# EAGLE schematic EEZ Arduino shield+BP r1B13a (EAGLE 6.1)
Assembly variants: Farnell, TME

## Sheet 1 of 5
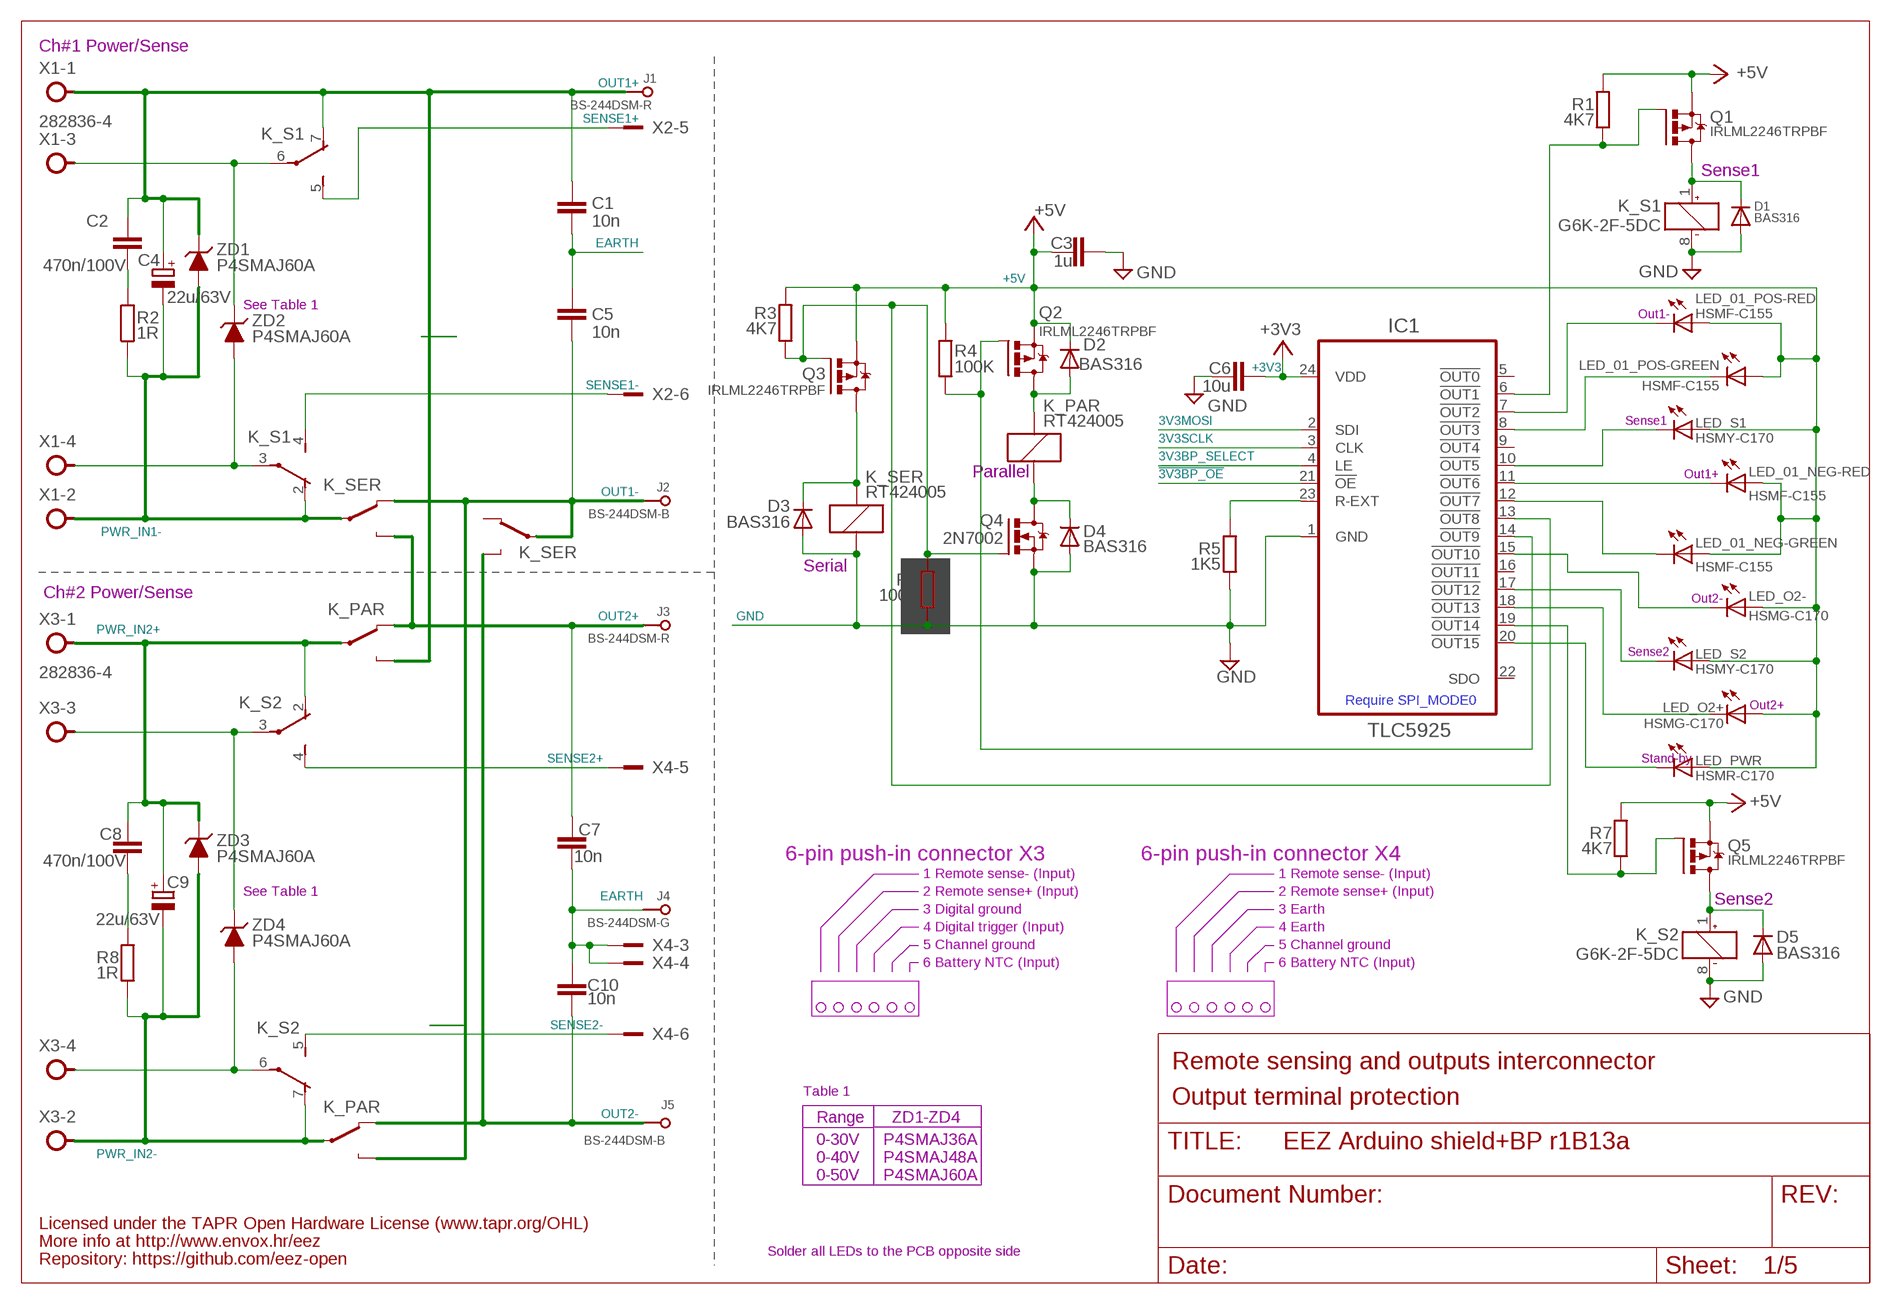
[diagram p0: schematic, sheet 1]

### Parts
C1  10n  C-EUC1206  [C1206]
C2  470n/100V  C-EUC1812  [C1812]
C3  1u  C-EUC0805  [C0805]
C4  22u/63V  ECAPEEEFK+2.5MM  [CAPAE660X610N_COMBO2]
C5  10n  C-EUC1206  [C1206]
C6  10u  C-EUC1206  [C1206]
C7  10n  C-EUC1206  [C1206]
C8  470n/100V  C-EUC1812  [C1812]
C9  22u/63V  ECAPEEEFK+2.5MM  [CAPAE660X610N_COMBO2]
C10  10n  C-EUC1206  [C1206]
D1  BAS316  DIODE-SOD323-W  [SOD323-W]
D2  BAS316  DIODE-SOD323-W  [SOD323-W]
D3  BAS316  DIODE-SOD323-W  [SOD323-W]
D4  BAS316  DIODE-SOD323-W  [SOD323-W]
D5  BAS316  DIODE-SOD323-W  [SOD323-W]
IC1  TLC5925  TLC5925IDBQR  [SOP63P600X175-24N]
J1  BS-244DSM-R  BINDING_POST-2  [BP_5_12]
J2  BS-244DSM-B  BINDING_POST-2  [BP_5_12]
J3  BS-244DSM-R  BINDING_POST-2  [BP_5_12]
J4  BS-244DSM-G  BINDING_POST-2  [BP_5_12]
J5  BS-244DSM-B  BINDING_POST-2  [BP_5_12]
K_PAR  RT424005  RELAY_RT314012-2  [RT-C/016A5_ROUND]
K_S1  G6K-2F-5DC  G6K-2F  [G6K-2F]
K_S2  G6K-2F-5DC  G6K-2F  [G6K-2F]
K_SER  RT424005  RELAY_RT314012-2  [RT-C/016A5_ROUND]
LED_01_NEG  HSMF-C155  LED_KPB-3025  [LED_KPB-3025]
LED_01_POS  HSMF-C155  LED_KPB-3025  [LED_KPB-3025]
LED_O2+  HSMG-C170  LEDCHIPLED_0805  [CHIPLED_0805]
LED_O2-  HSMG-C170  LEDCHIPLED_0805  [CHIPLED_0805]
LED_PWR  HSMR-C170  LEDCHIPLED_0805  [CHIPLED_0805]
LED_S1  HSMY-C170  LEDCHIPLED_0805  [CHIPLED_0805]
LED_S2  HSMY-C170  LEDCHIPLED_0805  [CHIPLED_0805]
Q1  IRLML2246TRPBF  [SOT95P237X112-3N]
Q2  IRLML2246TRPBF  [SOT95P237X112-3N]
Q3  IRLML2246TRPBF  [SOT95P237X112-3N]
Q4  2N7002  [SOT103P240X110-3N]
Q5  IRLML2246TRPBF  [SOT95P237X112-3N]
R1  4K7  R-EU_R0805  [R0805]
R2  1R  R-EU_R0805  [R0805]
R3  4K7  R-EU_R0805  [R0805]
R4  100K  R-EU_R0805  [R0805]
R5  1K5  R-EU_R0805  [R0805]
R6  100K  R-EU_R0805  [R0805]
R7  4K7  R-EU_R0805  [R0805]
R8  1R  R-EU_R0805  [R0805]
X1  282836-4  TBLOCK5.0_4A  [TBLOCK5.0_4]
X2  MC000005  MC000005MIRROR  [MC000005_MIRROR]
X3  282836-4  TBLOCK5.0_4A  [TBLOCK5.0_4]
X4  MC000005  MC000005MIRROR  [MC000005_MIRROR]
ZD1  P4SMAJ60A  PSMAXX  [DO214AC]
ZD2  P4SMAJ60A  PSMAXX  [DO214AC]
ZD3  P4SMAJ60A  PSMAXX  [DO214AC]
ZD4  P4SMAJ60A  PSMAXX  [DO214AC]

### Nets
3V3BP_SELECT: IC1.4(LE) ; also sheet 2
3V3MOSI: IC1.2(SDI) ; also sheet 2,3,4
3V3SCLK: IC1.3(CLK) ; also sheet 2,3,4
!3V3BP_OE: IC1.21(!OE) ; also sheet 2
!BP_OUT1: IC1.6(!OUT1) Q1.1(G) R1.1
!BP_OUT2: IC1.7(!OUT2) LED_01_POS.4(-RED:C)
!BP_OUT3: IC1.8(!OUT3) LED_01_POS.2(-GREEN:C)
!BP_OUT5: IC1.10(!OUT5) LED_S1.C
!BP_OUT6: IC1.11(!OUT6) LED_01_NEG.4(-RED:C)
!BP_OUT7: IC1.12(!OUT7) LED_01_NEG.2(-GREEN:C)
!BP_OUT8: IC1.13(!OUT8) Q3.1(G) Q4.1(G) R3.1 R6.2
!BP_OUT9: IC1.14(!OUT9) Q2.1(G) R4.1
!BP_OUT10: IC1.15(!OUT10) LED_O2-.C
!BP_OUT12: IC1.17(!OUT12) LED_S2.C
!BP_OUT13: IC1.18(!OUT13) LED_O2+.C
!BP_OUT14: IC1.19(!OUT14) Q5.1(G) R7.1
!BP_OUT15: IC1.20(!OUT15) LED_PWR.C
+3V3 [power]: C6.1 IC1.24(VDD) ; also sheet 2,3,4
+5V: C3.1 D2.C LED_01_NEG.1(-GREEN:A) LED_01_NEG.3(-RED:A) LED_01_POS.1(-GREEN:A) LED_01_POS.3(-RED:A) LED_O2+.A LED_O2-.A LED_PWR.A LED_S1.A LED_S2.A Q1.2(S) Q2.2(S) Q3.2(S) Q5.2(S) R1.2 R3.2 R4.2 R7.2 ; also sheet 2,4,5
EARTH: C1.2 C5.1 C7.2 C10.1 J4.P$1 X4.3 X4.3.1 X4.4 X4.4.1 ; also sheet 4
GND [gnd]: C3.2 C6.2 D1.A D3.A D4.A D5.A IC1.1(GND) K_S1.8(1:-) K_S2.8(1:-) K_SER.A1(C2) Q4.2(S) R5.1 R6.1 ; also sheet 2,3,4,5
N$5: K_S2.6(3:P) X3.P$4 ZD4.A
N$6: K_S1.6(3:P) X1.P$3 ZD2.C
N$7: K_S2.3(2:P) X3.P$3 ZD4.C
N$8: D1.C K_S1.1(1:+) Q1.3(D)
N$9: D5.C K_S2.1(1:+) Q5.3(D)
N$31: C2.2 R2.2
N$32: C8.2 R8.2
N$35: K_S1.3(2:P) X1.P$4 ZD2.A
N$155: D3.C K_SER.A2(C1) Q3.3(D)
N$156: D2.A K_PAR.A2(C1) Q2.3(D)
N$306: IC1.23(R-EXT) R5.2
OUT1+: C1.1 C2.1 C4.1(+) C4.1.1(+) J1.P$1 K_PAR.14A(O) K_S1.7(3:O) X1.P$1 ZD1.C
OUT1-: C5.2 J2.P$1 K_PAR.14B(O) K_SER.11B(P) K_SER.12A(S)
OUT2+: C7.1 J3.P$1 K_PAR.12A(S) K_SER.14A(O)
OUT2-: C10.2 J5.P$1 K_PAR.12B(S) K_SER.14B(O)
PWR_IN1-: C4.2(-) C4.2.1(-) K_S1.2(2:O) K_SER.11A(P) R2.1 X1.P$2 ZD1.A
PWR_IN2+: C8.1 C9.1(+) C9.1.1(+) K_PAR.11A(P) K_S2.2(2:O) X3.P$1 ZD3.C
PWR_IN2-: C9.2(-) C9.2.1(-) K_PAR.11B(P) K_S2.7(3:O) R8.1 X3.P$2 ZD3.A
SENSE1+: K_S1.5(3:S) X2.5 X2.5.1
SENSE1-: K_S1.4(2:S) X2.6 X2.6.1
SENSE2+: K_S2.4(2:S) X4.5 X4.5.1
SENSE2-: K_S2.5(3:S) X4.6 X4.6.1
V-2: D4.C K_PAR.A1(C2) Q4.3(D)
Unconnected: IC1.5(!OUT0) IC1.9(!OUT4) IC1.16(!OUT11) IC1.22(SDO) K_SER.12B(S)

### Notes on the sheet
- Ch#1 Power/Sense
- Sense1
- See Table 1 | Out1-
- Sense1
- Parallel
- Out1+
- Serial
- Out2-
- Ch#2 Power/Sense
- Sense2
- Require SPI_MODE0
- Out2+
- Stand-by
- 6-pin push-in connector X3 | 6-pin push-in connector X4
- 1 Remote sense- (Input) | 1 Remote sense- (Input)
- See Table 1 | 2 Remote sense+ (Input) | 2 Remote sense+ (Input)
- Sense2
- 3 Digital ground | 3 Earth
- 4 Digital trigger (Input) | 4 Earth
- 5 Channel ground | 5 Channel ground
- 6 Battery NTC (Input) | 6 Battery NTC (Input)
- Remote sensing and outputs interconnector
- Table 1
- Output terminal protection
- Range | ZD1-ZD4
- 0-30V | P4SMAJ36A
- 0-40V | P4SMAJ48A
- 0-50V | P4SMAJ60A
- Licensed under the TAPR Open Hardware License (www.tapr.org/OHL)
- More info at http://www.envox.hr/eez
- Solder all LEDs to the PCB opposite side
- Repository: https://github.com/eez-open

## Sheet 2 of 5
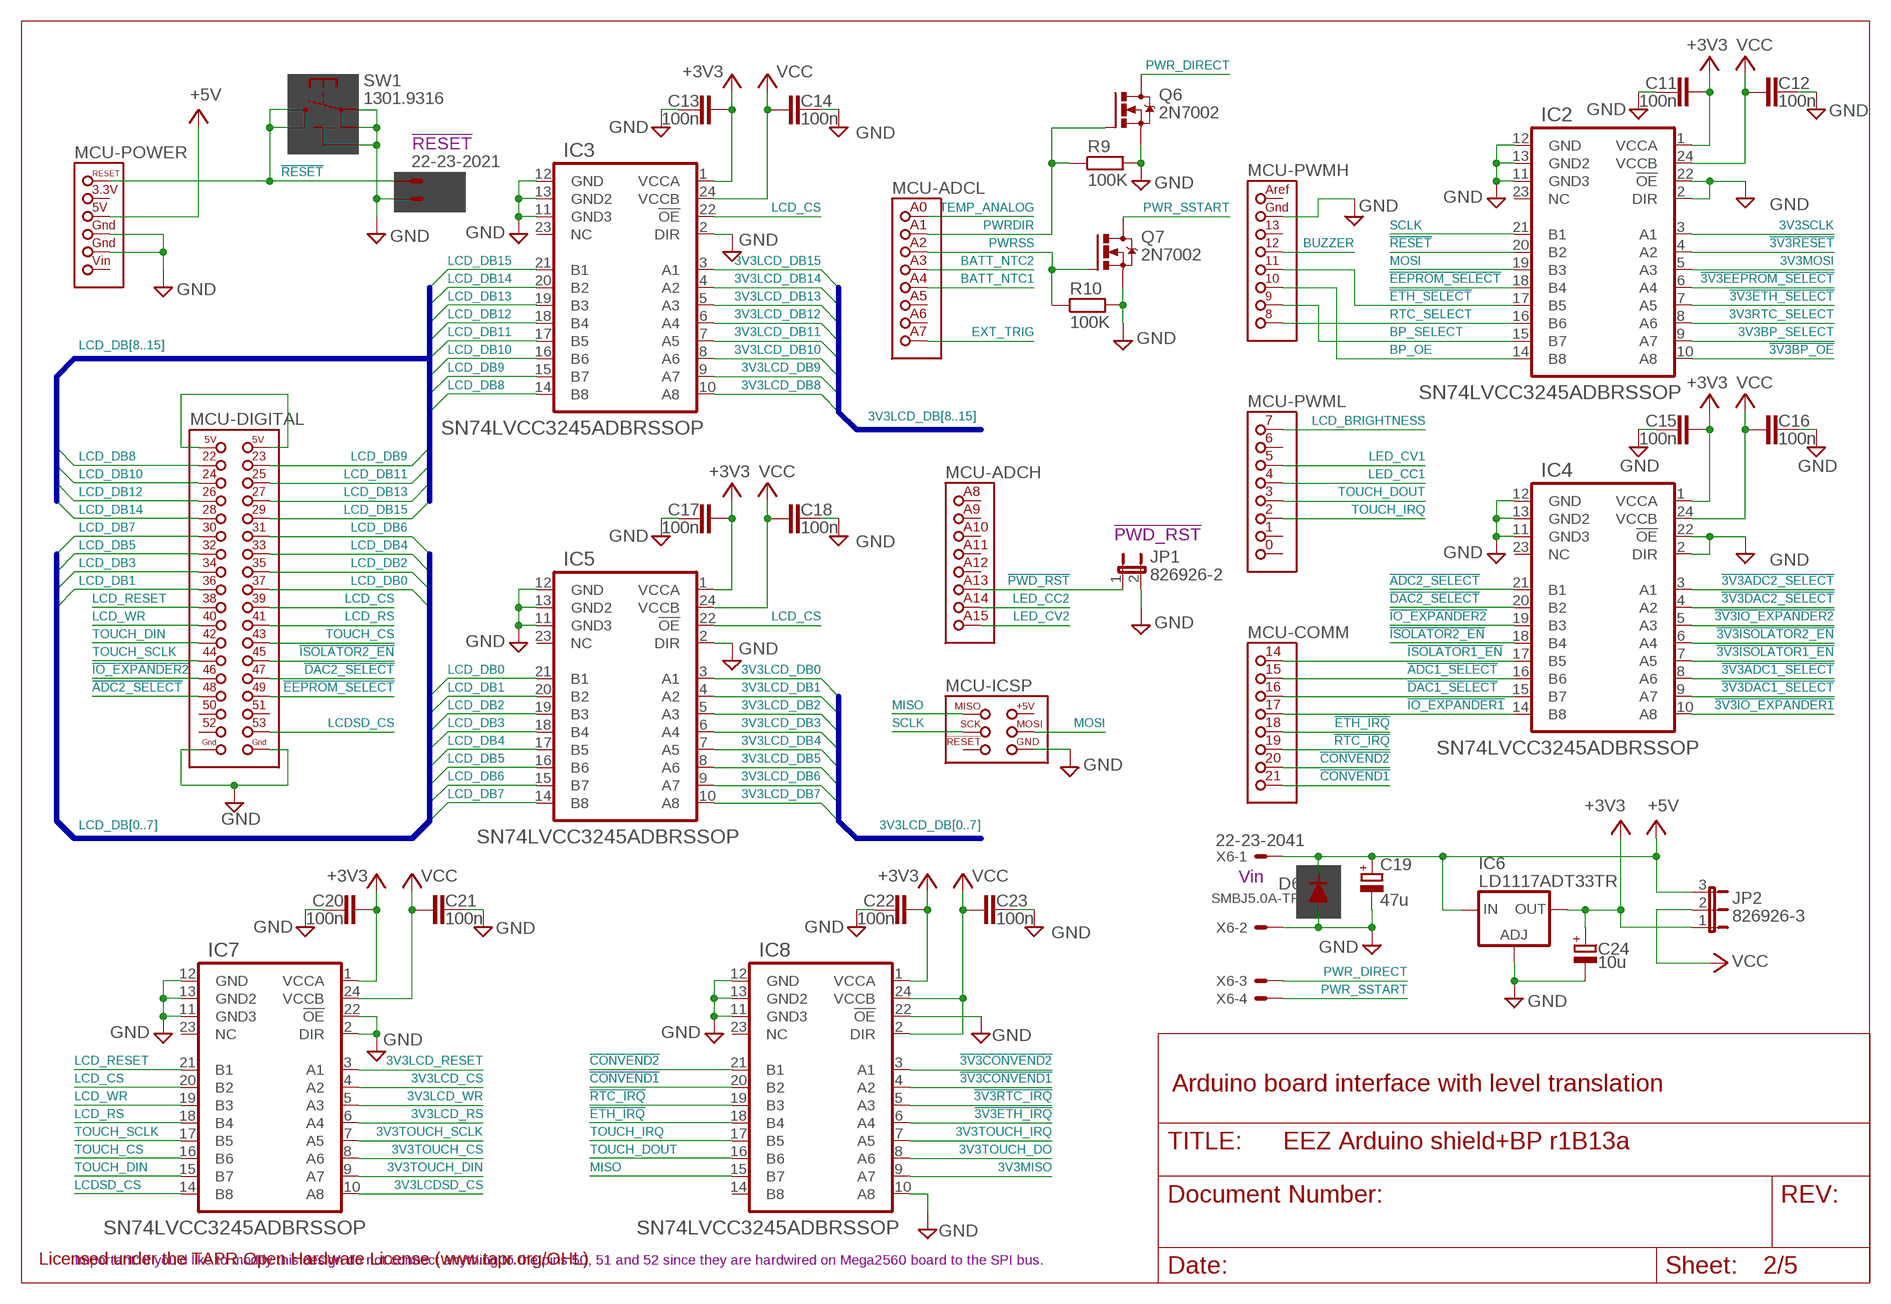
[diagram p1: schematic, sheet 2]

### Parts
C11  100n  C-EUC0603  [C0603]
C12  100n  C-EUC0603  [C0603]
C13  100n  C-EUC0603  [C0603]
C14  100n  C-EUC0603  [C0603]
C15  100n  C-EUC0603  [C0603]
C16  100n  C-EUC0603  [C0603]
C17  100n  C-EUC0603  [C0603]
C18  100n  C-EUC0603  [C0603]
C19  47u  ECAPPANASONIC_C  [PANASONIC_C]
C20  100n  C-EUC0603  [C0603]
C21  100n  C-EUC0603  [C0603]
C22  100n  C-EUC0603  [C0603]
C23  100n  C-EUC0603  [C0603]
C24  10u  ECAPPANASONIC_C  [PANASONIC_C]
D6  SMBJ5.0A-TR  DIODEDO214AA  [DO214AA]
IC2  SN74LVCC3245ADBRSSOP  [SOP65P780X200-24N]
IC3  SN74LVCC3245ADBRSSOP  [SOP65P780X200-24N]
IC4  SN74LVCC3245ADBRSSOP  [SOP65P780X200-24N]
IC5  SN74LVCC3245ADBRSSOP  [SOP65P780X200-24N]
IC6  LD1117ADT33TR  LD117ADT33TR  [DPACK]
IC7  SN74LVCC3245ADBRSSOP  [SOP65P780X200-24N]
IC8  SN74LVCC3245ADBRSSOP  [SOP65P780X200-24N]
JP1  826926-2  JP1E  [JP1]
JP2  826926-3  JUMPER_3-PIN  [JUMPER_3-PIN]
MCU  ARDUINO_MEGA+ICSPMIRROR  [ARDUINO+ICSP_MIRROR]
Q6  2N7002  [SOT103P240X110-3N]
Q7  2N7002  [SOT103P240X110-3N]
R9  100K  R-EU_R0805  [R0805]
R10  100K  R-EU_R0805  [R0805]
SW1  1301.9316  TACT_SW  [TACTM-6XN]
X5  22-23-2021  [22-23-2021]
X6  22-23-2041  [22-23-2041]

### Nets
3V3BP_SELECT: IC2.9(A7) ; also sheet 1
3V3LCD_CS: IC7.4(A2) ; also sheet 4
3V3LCD_DB0: IC5.3(A1) ; also sheet 4
3V3LCD_DB1: IC5.4(A2) ; also sheet 4
3V3LCD_DB2: IC5.5(A3) ; also sheet 4
3V3LCD_DB3: IC5.6(A4) ; also sheet 4
3V3LCD_DB4: IC5.7(A5) ; also sheet 4
3V3LCD_DB5: IC5.8(A6) ; also sheet 4
3V3LCD_DB6: IC5.9(A7) ; also sheet 4
3V3LCD_DB7: IC5.10(A8) ; also sheet 4
3V3LCD_DB8: IC3.10(A8) ; also sheet 4
3V3LCD_DB9: IC3.9(A7) ; also sheet 4
3V3LCD_DB10: IC3.8(A6) ; also sheet 4
3V3LCD_DB11: IC3.7(A5) ; also sheet 4
3V3LCD_DB12: IC3.6(A4) ; also sheet 4
3V3LCD_DB13: IC3.5(A3) ; also sheet 4
3V3LCD_DB14: IC3.4(A2) ; also sheet 4
3V3LCD_DB15: IC3.3(A1) ; also sheet 4
3V3LCD_RESET: IC7.3(A1) ; also sheet 4
3V3LCD_RS: IC7.6(A4) ; also sheet 4
3V3LCD_WR: IC7.5(A3) ; also sheet 4
3V3LCDSD_CS: IC7.10(A8) ; also sheet 4
3V3MISO: IC8.9(A7) ; also sheet 3,4
3V3MOSI: IC2.5(A3) ; also sheet 1,3,4
3V3RTC_SELECT: IC2.8(A6) ; also sheet 4
3V3SCLK: IC2.3(A1) ; also sheet 1,3,4
3V3TOUCH_CS: IC7.8(A6) ; also sheet 4
3V3TOUCH_DIN: IC7.9(A7) ; also sheet 4
3V3TOUCH_DO: IC8.8(A6) ; also sheet 4
3V3TOUCH_IRQ: IC8.7(A5) ; also sheet 4
3V3TOUCH_SCLK: IC7.7(A5) ; also sheet 4
!3V3ADC1_SELECT: IC4.8(A6) ; also sheet 3
!3V3ADC2_SELECT: IC4.3(A1) ; also sheet 3
!3V3BP_OE: IC2.10(A8) ; also sheet 1
!3V3CONVEND1: IC8.4(A2) ; also sheet 3
!3V3CONVEND2: IC8.3(A1) ; also sheet 3
!3V3DAC1_SELECT: IC4.9(A7) ; also sheet 3
!3V3DAC2_SELECT: IC4.4(A2) ; also sheet 3
!3V3EEPROM_SELECT: IC2.6(A4) ; also sheet 4
!3V3ETH_IRQ: IC8.6(A4) ; also sheet 4
!3V3ETH_SELECT: IC2.7(A5) ; also sheet 4
!3V3IO_EXPANDER1: IC4.10(A8) ; also sheet 3
!3V3IO_EXPANDER2: IC4.5(A3) ; also sheet 3
!3V3ISOLATOR1_EN: IC4.7(A5) ; also sheet 3
!3V3ISOLATOR2_EN: IC4.6(A4) ; also sheet 3
!3V3RESET: IC2.4(A2) ; also sheet 3,4
!3V3RTC_IRQ: IC8.5(A3) ; also sheet 4
!ADC1_SELECT: IC4.16(B6) MCU.15
!ADC2_SELECT: IC4.21(B1) MCU.48(-DIGITAL:48(PL3))
!CONVEND1: IC8.20(B2) MCU.21
!CONVEND2: IC8.21(B1) MCU.20
!DAC1_SELECT: IC4.15(B7) MCU.16
!DAC2_SELECT: IC4.20(B2) MCU.47(-DIGITAL:47(PL4))
!EEPROM_SELECT: IC2.18(B4) MCU.49(-DIGITAL:49(PL2))
!ETH_IRQ: IC8.18(B4) MCU.18
!ETH_SELECT: IC2.17(B5) MCU.11
!IO_EXPANDER1: IC4.14(B8) MCU.17
!IO_EXPANDER2: IC4.19(B3) MCU.46(-DIGITAL:46(PL5))
!ISOLATOR1_EN: IC4.17(B5) MCU.14
!ISOLATOR2_EN: IC4.18(B4) MCU.45(-DIGITAL:45(PL6))
!PWD_RST: JP1.1 MCU.A13(-ADCH:ADC13)
!RESET: IC2.20(B2) MCU.RESET(-POWER:!RESET) SW1.3 SW1.4 X5.2
!RTC_IRQ: IC8.19(B3) MCU.19
+3V3 [power]: C11.1 C13.1 C15.1 C17.1 C20.1 C22.1 C24.1(+) IC2.1(VCCA) IC3.1(VCCA) IC4.1(VCCA) IC5.1(VCCA) IC6.4(OUT) IC7.1(VCCA) IC8.1(VCCA) JP2.1 ; also sheet 1,3,4
+5V: C19.1(+) D6.C IC6.3(IN) JP2.3 MCU.5V(-POWER:5V) X6.1 ; also sheet 1,4,5
BATT_NTC1: MCU.A4(-ADCL:ADC4) ; also sheet 5
BATT_NTC2: MCU.A3(-ADCL:ADC3) ; also sheet 5
BP_OE: IC2.14(B8) MCU.10
BP_SELECT: IC2.15(B7) MCU.9(-PWMH:9(PH6))
BUZZER: MCU.12 ; also sheet 4
EXT_TRIG: MCU.A7(-ADCL:ADC7) ; also sheet 5
GND [gnd]: C11.2 C12.1 C13.2 C14.1 C15.2 C16.1 C17.2 C18.1 C19.2(-) C20.2 C21.1 C22.2 C23.1 C24.2(-) D6.A IC2.2(DIR) IC2.11(GND3) IC2.12(GND) IC2.13(GND2) IC2.22(!OE) IC3.2(DIR) IC3.11(GND3) IC3.12(GND) IC3.13(GND2) IC4.2(DIR) IC4.11(GND3) IC4.12(GND) IC4.13(GND2) IC4.22(!OE) IC5.2(DIR) IC5.11(GND3) IC5.12(GND) IC5.13(GND2) IC6.1(ADJ) IC7.2(DIR) IC7.11(GND3) IC7.12(GND) IC7.13(GND2) IC7.22(!OE) IC8.10(A8) IC8.11(GND3) IC8.12(GND) IC8.13(GND2) IC8.22(!OE) JP1.2 MCU.GND1(-POWER:GND1) MCU.GND2(-POWER:GND2) MCU.GND3(-DIGITAL:GND3) MCU.GND4(-DIGITAL:GND4) MCU.GND(-PWMH:GND) MCU.ICSP_GND(-ICSP:GND) Q6.2(S) Q7.2(S) R9.2 R10.2 SW1.1 SW1.2 SW1.5(5-GND) X5.1 X6.2 ; also sheet 1,3,4,5
LCD_BRIGHTNESS: MCU.7(-PWML:7(PH4)) ; also sheet 4
LCD_CS: IC3.22(!OE) IC5.22(!OE) IC7.20(B2) MCU.39(-DIGITAL:39(PC0))
LCD_DB0: IC5.21(B1) MCU.37(-DIGITAL:37(PC2))
LCD_DB1: IC5.20(B2) MCU.36(-DIGITAL:36(PC3))
LCD_DB2: IC5.19(B3) MCU.35(-DIGITAL:35(PC4))
LCD_DB3: IC5.18(B4) MCU.34(-DIGITAL:34(PC5))
LCD_DB4: IC5.17(B5) MCU.33(-DIGITAL:33(PC6))
LCD_DB5: IC5.16(B6) MCU.32(-DIGITAL:32(PC7))
LCD_DB6: IC5.15(B7) MCU.31(-DIGITAL:31(PA7))
LCD_DB7: IC5.14(B8) MCU.30(-DIGITAL:30(PA6))
LCD_DB8: IC3.14(B8) MCU.22
LCD_DB9: IC3.15(B7) MCU.23
LCD_DB10: IC3.16(B6) MCU.24(-DIGITAL:24(PA0))
LCD_DB11: IC3.17(B5) MCU.25(-DIGITAL:25(PA1))
LCD_DB12: IC3.18(B4) MCU.26(-DIGITAL:26(PA2))
LCD_DB13: IC3.19(B3) MCU.27(-DIGITAL:27(PA3))
LCD_DB14: IC3.20(B2) MCU.28(-DIGITAL:28(PA4))
LCD_DB15: IC3.21(B1) MCU.29(-DIGITAL:29(PA5))
LCD_RESET: IC7.21(B1) MCU.38(-DIGITAL:38(PC1))
LCD_RS: IC7.18(B4) MCU.41(-DIGITAL:41(PG2))
LCD_WR: IC7.19(B3) MCU.40(-DIGITAL:40(PD7))
LCDSD_CS: IC7.14(B8) MCU.53(-DIGITAL:53(PB2/MOSI))
LED_CC1: MCU.4(-PWML:4(PG5)) ; also sheet 5
LED_CC2: MCU.A14(-ADCH:ADC14) ; also sheet 5
LED_CV1: MCU.5(-PWML:5(PE3)) ; also sheet 5
LED_CV2: MCU.A15(-ADCH:ADC15) ; also sheet 5
MISO: IC8.15(B7) MCU.ICSP_MISO(-ICSP:MISO)
MOSI: IC2.19(B3) MCU.ICSP_MOSI(-ICSP:MOSI)
N$20: MCU.5V(1)(-DIGITAL:5V(1)) MCU.5V(2)(-DIGITAL:5V(2))
PWR_DIRECT: Q6.3(D) X6.3
PWR_SSTART: Q7.3(D) X6.4
PWRDIR: MCU.A1(-ADCL:ADC1) Q6.1(G) R9.1
PWRSS: MCU.A2(-ADCL:ADC2) Q7.1(G) R10.1
RTC_SELECT: IC2.16(B6) MCU.8(-PWMH:8(PH5))
SCLK: IC2.21(B1) MCU.ICSP_SCK(-ICSP:SCK)
TEMP_ANALOG: MCU.A0(-ADCL:ADC0) ; also sheet 4
TOUCH_CS: IC7.16(B6) MCU.43(-DIGITAL:43(PG0))
TOUCH_DIN: IC7.15(B7) MCU.42(-DIGITAL:42(PG1))
TOUCH_DOUT: IC8.16(B6) MCU.3(-PWML:3(PE5))
TOUCH_IRQ: IC8.17(B5) MCU.2(-PWML:2(PE4))
TOUCH_SCLK: IC7.17(B5) MCU.44(-DIGITAL:44(PL7))
VCC [power]: C12.2 C14.2 C16.2 C18.2 C21.2 C23.2 IC2.24(VCCB) IC3.24(VCCB) IC4.24(VCCB) IC5.24(VCCB) IC7.24(VCCB) IC8.2(DIR) IC8.24(VCCB) JP2.2 ; also sheet 4,5
Unconnected: IC2.23(NC) IC3.23(NC) IC4.23(NC) IC5.23(NC) IC7.23(NC) IC8.14(B8) IC8.23(NC) MCU.0(-PWML:0(PE0)) MCU.1(-PWML:1(PE1)) MCU.3.3V(-POWER:3V3) MCU.6(-PWML:6(PH3)) MCU.13 MCU.50(-DIGITAL:50(PL1/MISO)) MCU.51(-DIGITAL:51(PL0)) MCU.52(-DIGITAL:52(PB3/SCK)) MCU.A5(-ADCL:ADC5) MCU.A6(-ADCL:ADC6) MCU.A8(-ADCH:ADC8) MCU.A9(-ADCH:ADC9) MCU.A10(-ADCH:ADC10) MCU.A11(-ADCH:ADC11) MCU.A12(-ADCH:ADC12) MCU.AREF(-PWMH:AREF) MCU.ICSP_+5V(-ICSP:+5V) MCU.ICSP_RESET(-ICSP:!RESET) MCU.VIN(-POWER:VIN)

### Buses
LCD_DB[8..15]
LCD_DB[0..7]
3V3LCD_DB[8..15]
3V3LCD_DB[0..7]

### Notes on the sheet
- !RESET
- !PWD_RST
- Vin
- Arduino board interface with level translation
- Licensed under the TAPR Open Hardware License (www.tapr.org/OHL) | Important: if you'd like to modify this design do not connect anything to the pins 50, 51 and 52 since they are hardwired on Mega2560 board to the SPI bus.

## Sheet 3 of 5
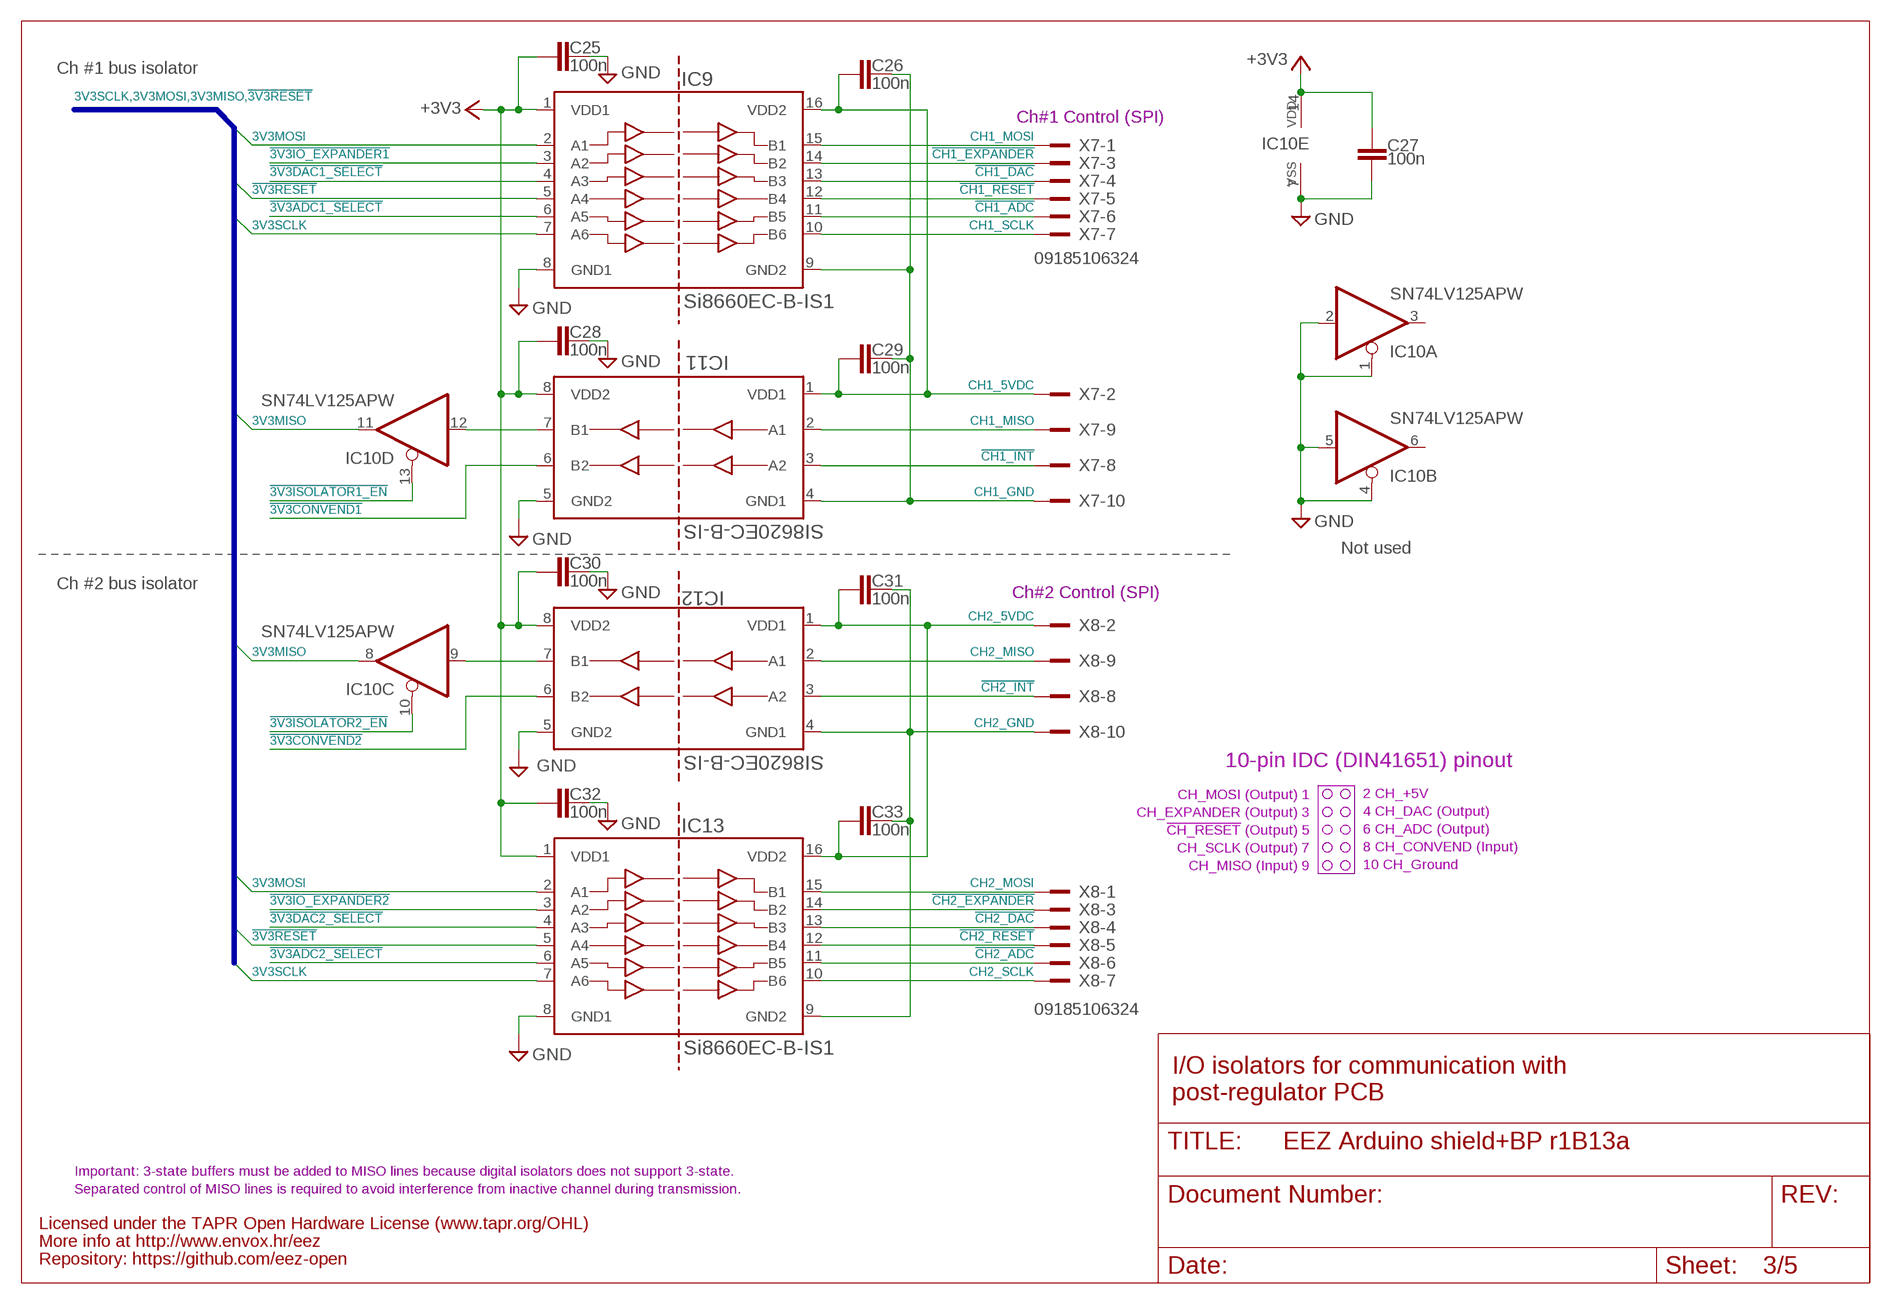
[diagram p2: schematic, sheet 3]

### Parts
C25  100n  C-EUC0603  [C0603]
C26  100n  C-EUC0603  [C0603]
C27  100n  C-EUC0603  [C0603]
C28  100n  C-EUC0603  [C0603]
C29  100n  C-EUC0603  [C0603]
C30  100n  C-EUC0603  [C0603]
C31  100n  C-EUC0603  [C0603]
C32  100n  C-EUC0603  [C0603]
C33  100n  C-EUC0603  [C0603]
IC9  Si8660EC-B-IS1  SI8660  [SOIC-16]
IC10  SN74LV125APW  SN74LV125ATSSOP14  [SOP65P640X120-14N]
IC11  SI8620EC-B-IS  SI8620  [SOIC127P600X173-8N]
IC12  SI8620EC-B-IS  SI8620  [SOIC127P600X173-8N]
IC13  Si8660EC-B-IS1  SI8660  [SOIC-16]
X7  09185106324  IDC-10PINGREY  [IDC-10PIN]
X8  09185106324  IDC-10PINGREY  [IDC-10PIN]

### Nets
3V3MISO: IC10.8(C:O) IC10.11(D:O) ; also sheet 2,4
3V3MOSI: IC9.2(A1) IC13.2(A1) ; also sheet 1,2,4
3V3SCLK: IC9.7(A6) IC13.7(A6) ; also sheet 1,2,4
!3V3ADC1_SELECT: IC9.6(A5) ; also sheet 2
!3V3ADC2_SELECT: IC13.6(A5) ; also sheet 2
!3V3CONVEND1: IC11.6(B2) ; also sheet 2
!3V3CONVEND2: IC12.6(B2) ; also sheet 2
!3V3DAC1_SELECT: IC9.4(A3) ; also sheet 2
!3V3DAC2_SELECT: IC13.4(A3) ; also sheet 2
!3V3IO_EXPANDER1: IC9.3(A2) ; also sheet 2
!3V3IO_EXPANDER2: IC13.3(A2) ; also sheet 2
!3V3ISOLATOR1_EN: IC10.13(D:OE) ; also sheet 2
!3V3ISOLATOR2_EN: IC10.10(C:OE) ; also sheet 2
!3V3RESET: IC9.5(A4) IC13.5(A4) ; also sheet 2,4
!CH1_ADC: IC9.11(B5) X7.6
!CH1_DAC: IC9.13(B3) X7.4
!CH1_EXPANDER: IC9.14(B2) X7.3
!CH1_INT: IC11.3(A2) X7.8
!CH1_RESET: IC9.12(B4) X7.5
!CH2_ADC: IC13.11(B5) X8.6
!CH2_DAC: IC13.13(B3) X8.4
!CH2_EXPANDER: IC13.14(B2) X8.3
!CH2_INT: IC12.3(A2) X8.8
!CH2_RESET: IC13.12(B4) X8.5
+3V3 [power]: C25.1 C27.2 C28.1 C30.1 C32.1 IC9.1(VDD1) IC10.14(E:VDD) IC11.8(VDD2) IC12.8(VDD2) IC13.1(VDD1) ; also sheet 1,2,4
CH1_5VDC: C26.1 C29.1 IC9.16(VDD2) IC11.1(VDD1) X7.2
CH1_GND [isolators]: C26.2 C29.2 IC9.9(GND2) IC11.4(GND1) X7.10
CH1_MISO: IC11.2(A1) X7.9
CH1_MOSI: IC9.15(B1) X7.1
CH1_SCLK: IC9.10(B6) X7.7
CH2_5VDC: C31.1 C33.1 IC12.1(VDD1) IC13.16(VDD2) X8.2
CH2_GND: C31.2 C33.2 IC12.4(GND1) IC13.9(GND2) X8.10
CH2_MISO: IC12.2(A1) X8.9
CH2_MOSI: IC13.15(B1) X8.1
CH2_SCLK: IC13.10(B6) X8.7
GND [gnd]: C25.2 C27.1 C28.2 C30.2 C32.2 IC9.8(GND1) IC10.1(A:OE) IC10.2(A:I) IC10.4(B:OE) IC10.5(B:I) IC10.7(E:VSS) IC11.5(GND2) IC12.5(GND2) IC13.8(GND1) ; also sheet 1,2,4,5
N$151: IC10.12(D:I) IC11.7(B1)
N$164: IC10.9(C:I) IC12.7(B1)
Unconnected: IC10.3(A:O) IC10.6(B:O)

### Buses
3V3SCLK,3V3MOSI,3V3MISO,!3V3RESET

### Notes on the sheet
- Ch #1 bus isolator
- Ch#1 Control (SPI)
- Not used
- Ch #2 bus isolator
- Ch#2 Control (SPI)
- 10-pin IDC (DIN41651) pinout
- CH_MOSI (Output) 1
- 2 CH_+5V
- CH_EXPANDER (Output) 3
- 4 CH_DAC (Output)
- !CH_RESET! (Output) 5
- 6 CH_ADC (Output)
- CH_SCLK (Output) 7
- 8 CH_CONVEND (Input)
- CH_MISO (Input) 9
- 10 CH_Ground
- I/O isolators for communication with
- post-regulator PCB
- Important: 3-state buffers must be added to MISO lines because digital isolators does not support 3-state.
- Separated control of MISO lines is required to avoid interference from inactive channel during transmission.
- Licensed under the TAPR Open Hardware License (www.tapr.org/OHL)
- More info at http://www.envox.hr/eez
- Repository: https://github.com/eez-open

## Sheet 4 of 5
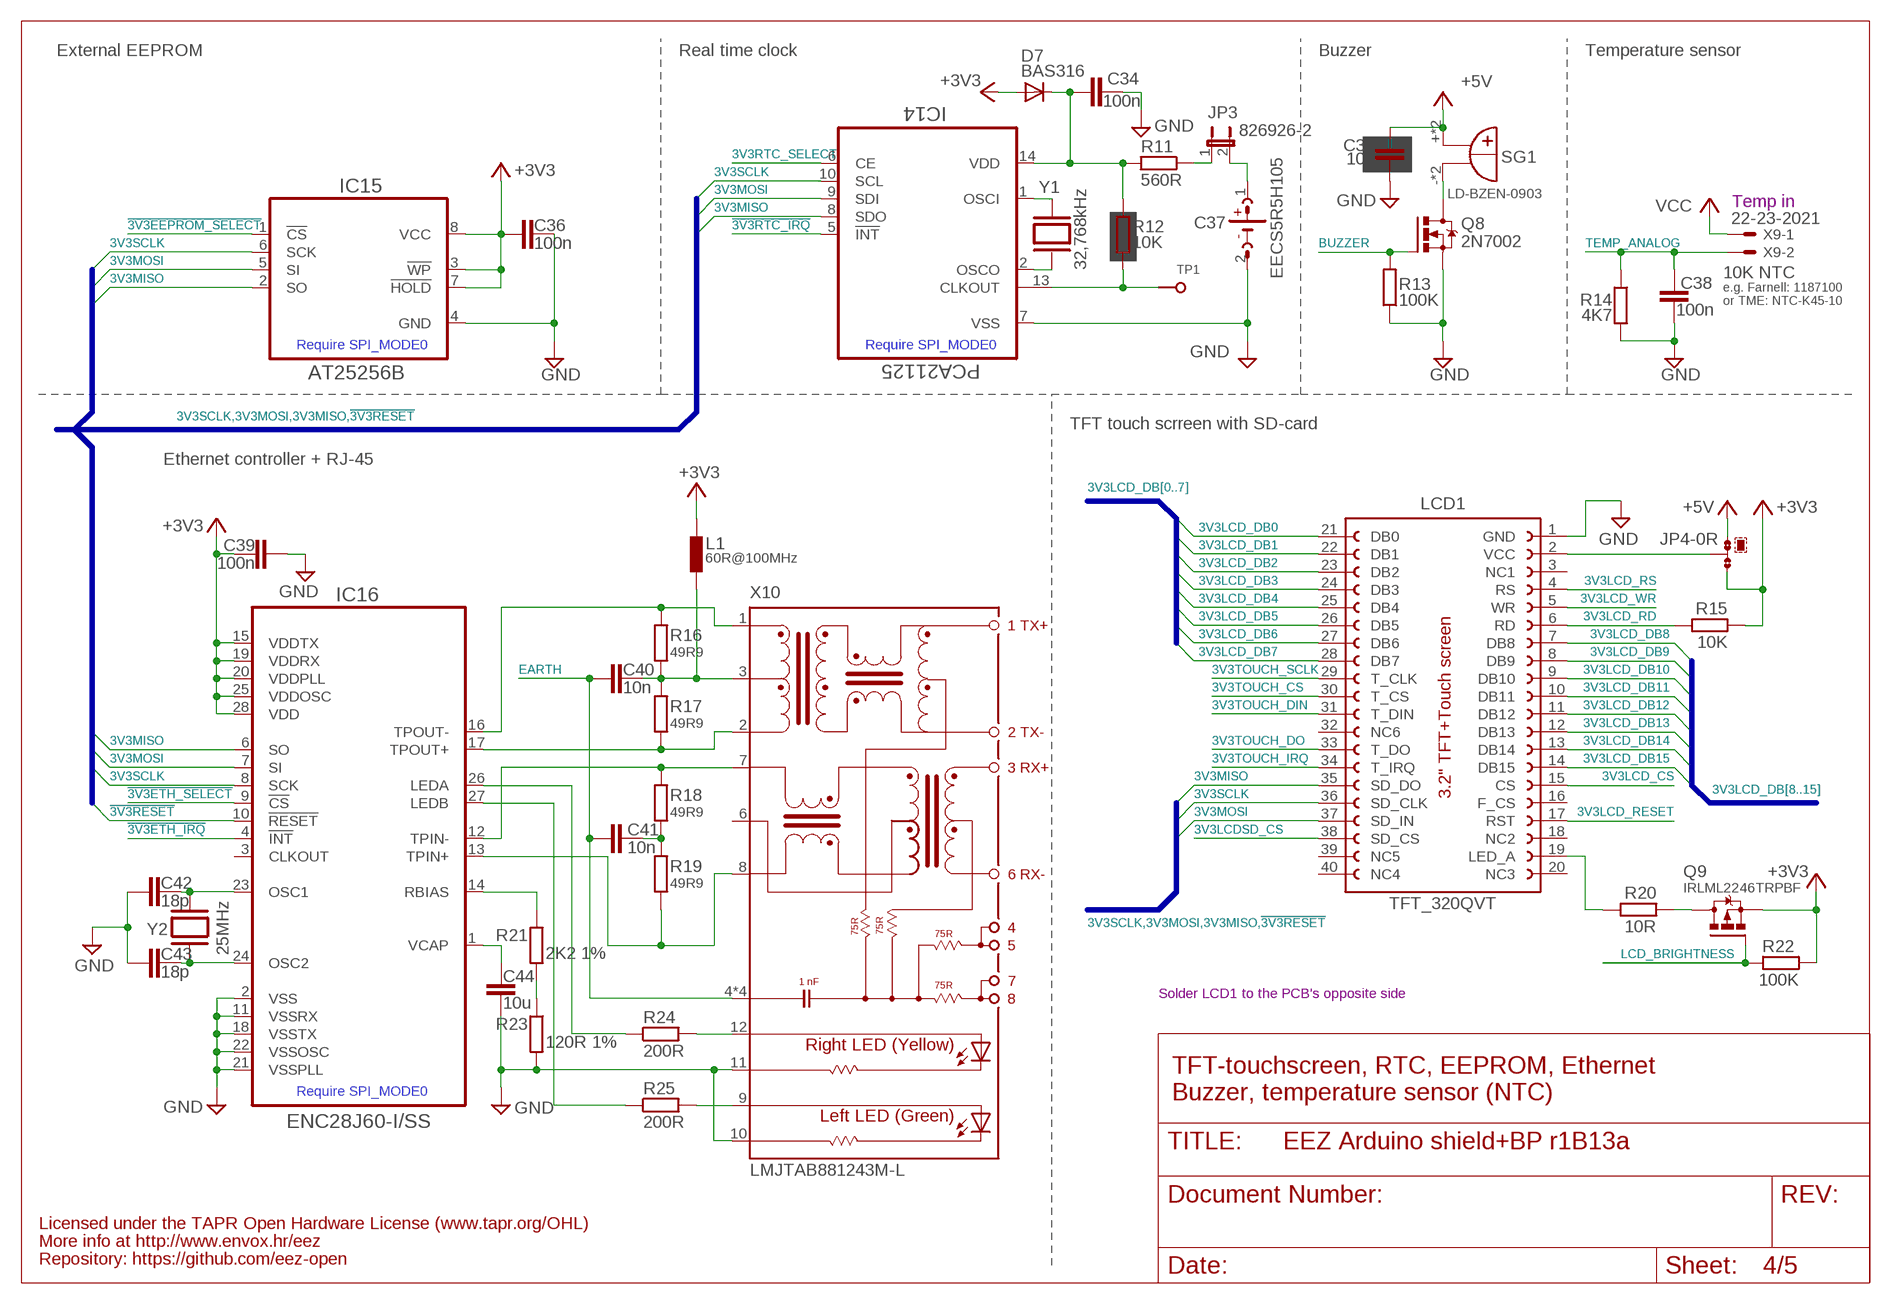
[diagram p3: schematic, sheet 4]

### Parts
C34  100n  C-EUC0603  [C0603]
C35  10u  C-EUC1206  [C1206]
C36  100n  C-EUC0603  [C0603]
C37  EECS5R5H105  SUPER_CAP  [SG-R20MM]
C38  100n  C-EUC0603  [C0603]
C39  100n  C-EUC0603  [C0603]
C40  10n  C-EUC1206  [C1206]
C41  10n  C-EUC1206  [C1206]
C42  18p  C-EUC0805  [C0805]
C43  18p  C-EUC0805  [C0805]
C44  10u  C-EUC1206  [C1206]
D7  BAS316  DIODE-SOD323-W  [SOD323-W]
IC14  PCA21125  PCA21125TSSOP-14  [SOP65P640X120-14N]
IC15  AT25256B  AT25XXXSOIC8  [SOIC127P600X175-8N]
IC16  ENC28J60-I/SS  [SOP65P780X200-28N]
JP3  826926-2  JP1E  [JP1]
JP4  0R-JUMPA  [A0R-JMP]
L1  60R@100MHz  FERRITE_BEAD0603  [BEAD0603]
LCD1  TFT_320QVT  LCD_TFT_320QVTMIRROR  [LCD_TFT_320QVT_MIRROR]
Q8  2N7002  [SOT103P240X110-3N]
Q9  IRLML2246TRPBF  [SOT95P237X112-3N]
R11  560R  R-EU_R0805  [R0805]
R12  10K  R-EU_R0805  [R0805]
R13  100K  R-EU_R0805  [R0805]
R14  4K7  R-EU_R0805  [R0805]
R15  10K  R-EU_R0805  [R0805]
R16  49R9  R-EU_R0805  [R0805]
R17  49R9  R-EU_R0805  [R0805]
R18  49R9  R-EU_R0805  [R0805]
R19  49R9  R-EU_R0805  [R0805]
R20  10R  R-EU_R0805  [R0805]
R21  2K2 1%  R-EU_R0805  [R0805]
R22  100K  R-EU_R0805  [R0805]
R23  120R 1%  R-EU_R0805  [R0805]
R24  200R  R-EU_R0805  [R0805]
R25  200R  R-EU_R0805  [R0805]
SG1  LD-BZEN-0903  BUZZER  [BUZZER]
TP1  PCB_TEST_TABSHIELD  [PCB_SHIELD_TAB]
X9  22-23-2021  [22-23-2021]
X10  LMJTAB881243M-L  RJ45-TRAFO-LED  [RJ45-TRAFO-LED]
Y1  32,768kHz  XTALR26  [R26_XTAL]
Y2  25MHz  XTALSMD  [HC-49/4H]

### Nets
3V3LCD_CS: LCD1.15(CS) ; also sheet 2
3V3LCD_DB0: LCD1.21(DB0) ; also sheet 2
3V3LCD_DB1: LCD1.22(DB1) ; also sheet 2
3V3LCD_DB2: LCD1.23(DB2) ; also sheet 2
3V3LCD_DB3: LCD1.24(DB3) ; also sheet 2
3V3LCD_DB4: LCD1.25(DB4) ; also sheet 2
3V3LCD_DB5: LCD1.26(DB5) ; also sheet 2
3V3LCD_DB6: LCD1.27(DB6) ; also sheet 2
3V3LCD_DB7: LCD1.28(DB7) ; also sheet 2
3V3LCD_DB8: LCD1.7(DB8) ; also sheet 2
3V3LCD_DB9: LCD1.8(DB9) ; also sheet 2
3V3LCD_DB10: LCD1.9(DB10) ; also sheet 2
3V3LCD_DB11: LCD1.10(DB11) ; also sheet 2
3V3LCD_DB12: LCD1.11(DB12) ; also sheet 2
3V3LCD_DB13: LCD1.12(DB13) ; also sheet 2
3V3LCD_DB14: LCD1.13(DB14) ; also sheet 2
3V3LCD_DB15: LCD1.14(DB15) ; also sheet 2
3V3LCD_RD: LCD1.6(RD) R15.1
3V3LCD_RESET: LCD1.17(RST) ; also sheet 2
3V3LCD_RS: LCD1.4(RS) ; also sheet 2
3V3LCD_WR: LCD1.5(WR) ; also sheet 2
3V3LCDSD_CS: LCD1.38(SD_CS) ; also sheet 2
3V3MISO: IC14.8(SDO) IC15.2(SO) IC16.6(SO) LCD1.35(SD_DO) ; also sheet 2,3
3V3MOSI: IC14.9(SDI) IC15.5(SI) IC16.7(SI) LCD1.37(SD_IN) ; also sheet 1,2,3
3V3RTC_SELECT: IC14.6(CE) ; also sheet 2
3V3SCLK: IC14.10(SCL) IC15.6(SCK) IC16.8(SCK) LCD1.36(SD_CLK) ; also sheet 1,2,3
3V3TOUCH_CS: LCD1.30(T_CS) ; also sheet 2
3V3TOUCH_DIN: LCD1.31(T_DIN) ; also sheet 2
3V3TOUCH_DO: LCD1.33(T_DO) ; also sheet 2
3V3TOUCH_IRQ: LCD1.34(T_IRQ) ; also sheet 2
3V3TOUCH_SCLK: LCD1.29(T_CLK) ; also sheet 2
!3V3EEPROM_SELECT: IC15.1(!CS) ; also sheet 2
!3V3ETH_IRQ: IC16.4(!INT) ; also sheet 2
!3V3ETH_SELECT: IC16.9(!CS) ; also sheet 2
!3V3RESET: IC16.10(!RESET) ; also sheet 2,3
!3V3RTC_IRQ: IC14.5(!INT) ; also sheet 2
+3V3 [power]: C36.1 C39.1 D7.A IC15.3(!WP) IC15.7(!HOLD) IC15.8(VCC) IC16.15(VDDTX) IC16.19(VDDRX) IC16.20(VDDPLL) IC16.25(VDDOSC) IC16.28(VDD) JP4.3 L1.P$2 Q9.2(S) R15.2 R22.2 ; also sheet 1,2,3
+5V: C35.2 JP4.1 SG1.+ SG1.+B(+) ; also sheet 1,2,5
BUZZER: Q8.1(G) R13.2 ; also sheet 2
EARTH: C40.2 C41.2 X10.4(SH) X10.5(SH) X10.SH1(SH) X10.SH2(SH) ; also sheet 1
ETH_IN+: IC16.13(TPIN+) R19.1 X10.8(RD-)
ETH_IN-: IC16.12(TPIN-) R18.2 X10.7(RD+)
ETH_LEDA: IC16.26(LEDA) R24.1
ETH_LEDB: IC16.27(LEDB) R25.1
ETH_OUT+: IC16.17(TPOUT+) R17.1 X10.2(TD-)
ETH_OUT-: IC16.16(TPOUT-) R16.2 X10.1(TD+)
GND [gnd]: C34.1 C35.1 C36.2 C37.2(-) C38.1 C39.2 C42.2 C43.2 C44.1 IC14.7(VSS) IC15.4(GND) IC16.2(VSS) IC16.11(VSSRX) IC16.18(VSSTX) IC16.21(VSSPLL) IC16.22(VSSOSC) LCD1.1(GND) Q8.2(S) R13.1 R14.2 R23.2 X10.10(GREEN-C) X10.11(YELLOW-C) ; also sheet 1,2,3,5
LCD_BRIGHTNESS: Q9.1(G) R22.1 ; also sheet 2
LED_A: LCD1.19(LED_A) R20.2
N$10 [power]: JP4.2 LCD1.2(VCC)
N$13: Q9.3(D) R20.1
N$24: IC14.1(OSCI) Y1.2
N$25: IC14.2(OSCO) Y1.1
N$30: R21.2 R23.1
N$34: JP3.1 R11.1
N$71: Q8.3(D) SG1.- SG1.-B(-)
N$83: IC14.13(CLKOUT) R12.2 TP1.1
N$84: C37.1(+) JP3.2
N$97: C42.1 IC16.23(OSC1) Y2.2
N$98: C43.1 IC16.24(OSC2) Y2.1
N$99: C44.2 IC16.1(VCAP)
N$101: IC16.14(RBIAS) R21.1
N$109: C34.2 D7.C IC14.14(VDD) R11.2 R12.1
N$115: R24.2 X10.12(YELLOW_A)
N$116: R25.2 X10.9(GREEN-A)
N$124: C41.1 R18.1 R19.2
N$125: C40.1 L1.P$1 R16.1 R17.2 X10.3(CT)
TEMP_ANALOG: C38.2 R14.1 X9.2 ; also sheet 2
VCC [power]: X9.1 ; also sheet 2,5
Unconnected: IC16.3(CLKOUT) LCD1.3(NC1) LCD1.16(F_CS) LCD1.18(NC2) LCD1.20(NC3) LCD1.32(NC6) LCD1.39(NC5) LCD1.40(NC4) X10.6(CR)

### Buses
3V3LCD_DB[8..15]
3V3LCD_DB[0..7]
3V3SCLK,3V3MOSI,3V3MISO,!3V3RESET

### Notes on the sheet
- External EEPROM | Real time clock | Buzzer | Temperature sensor
- Temp in
- 10K NTC
- e.g. Farnell: 1187100
- or TME: NTC-K45-10
- Require SPI_MODE0 | Require SPI_MODE0
- TFT touch scrreen with SD-card
- Ethernet controller + RJ-45
- Solder LCD1 to the PCB's opposite side
- TFT-touchscreen, RTC, EEPROM, Ethernet
- Require SPI_MODE0
- Buzzer, temperature sensor (NTC)
- Licensed under the TAPR Open Hardware License (www.tapr.org/OHL)
- More info at http://www.envox.hr/eez
- Repository: https://github.com/eez-open

## Sheet 5 of 5
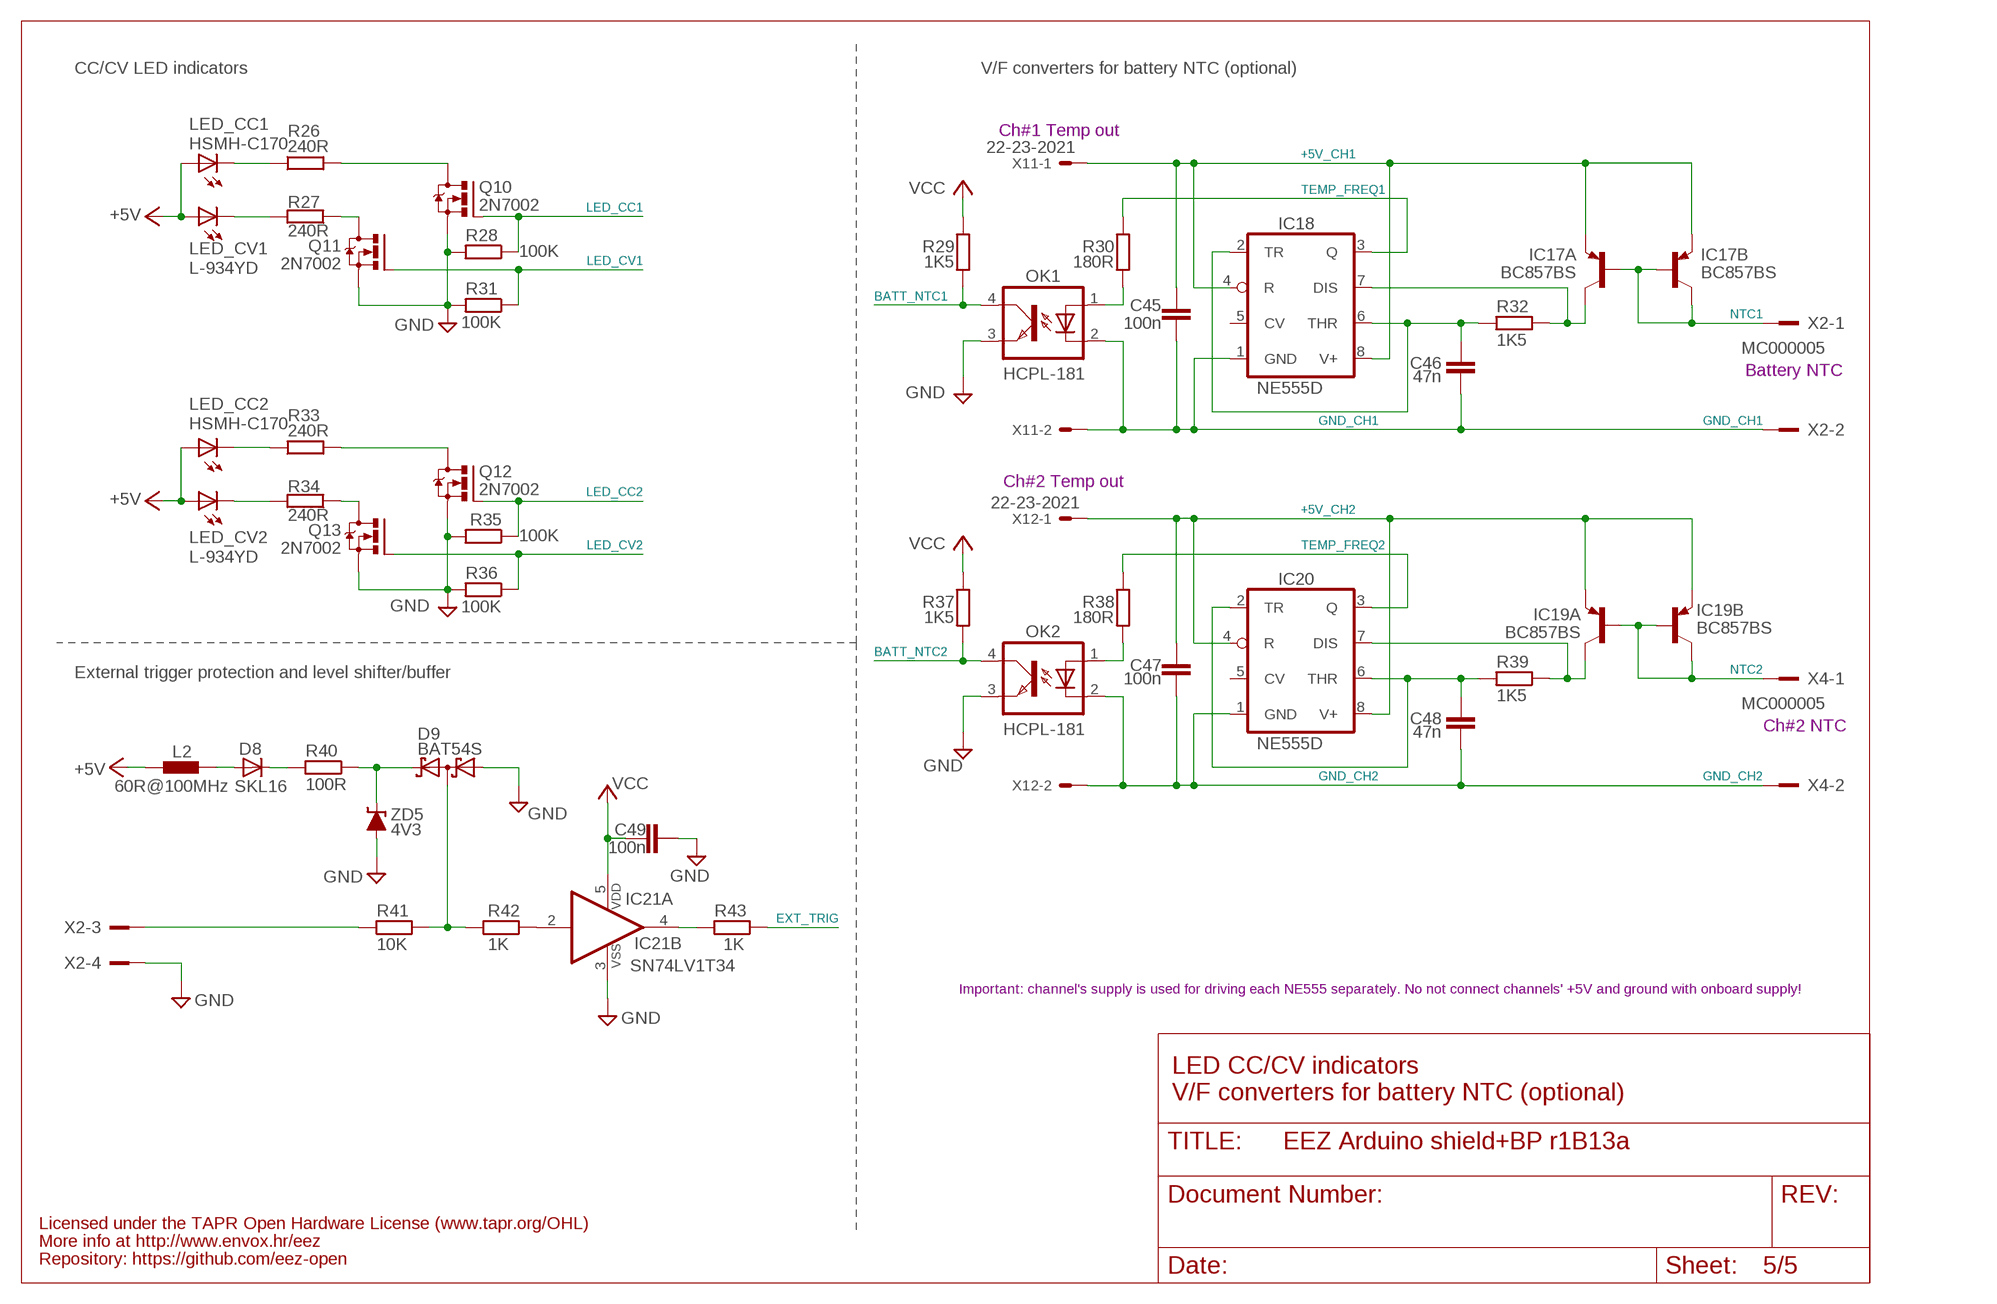
[diagram p4: schematic, sheet 5]

### Parts
C45  100n  C-EUC0603  [C0603]
C46  47n  C-EUC0805  [C0805]
C47  100n  C-EUC0603  [C0603]
C48  47n  C-EUC0805  [C0805]
C49  100n  C-EUC0603  [C0603]
D8  SKL16  DIODE-DO214AC  [DO214AC]
D9  BAT54S  [SOT23]
IC17  BC857BS  [SOT65P210X110-6N]
IC18  NE555D  LM555SOIC8  [SOIC127P600X175-8N]
IC19  BC857BS  [SOT65P210X110-6N]
IC20  NE555D  LM555SOIC8  [SOIC127P600X175-8N]
IC21  SN74LV1T34  [SOT95P280X145-5N]
L2  60R@100MHz  FERRITE_BEAD0603  [BEAD0603]
LED_CC1  HSMH-C170  LEDCHIPLED_0805  [CHIPLED_0805]
LED_CC2  HSMH-C170  LEDCHIPLED_0805  [CHIPLED_0805]
LED_CV1  L-934YD  LEDCHIPLED_0805  [CHIPLED_0805]
LED_CV2  L-934YD  LEDCHIPLED_0805  [CHIPLED_0805]
OK1  HCPL-181  [HCPL-181]
OK2  HCPL-181  [HCPL-181]
Q10  2N7002  [SOT103P240X110-3N]
Q11  2N7002  [SOT103P240X110-3N]
Q12  2N7002  [SOT103P240X110-3N]
Q13  2N7002  [SOT103P240X110-3N]
R26  240R  R-EU_R0805  [R0805]
R27  240R  R-EU_R0805  [R0805]
R28  100K  R-EU_R0805  [R0805]
R29  1K5  R-EU_R0805  [R0805]
R30  180R  R-EU_R0805  [R0805]
R31  100K  R-EU_R0805  [R0805]
R32  1K5  R-EU_R0805  [R0805]
R33  240R  R-EU_R0805  [R0805]
R34  240R  R-EU_R0805  [R0805]
R35  100K  R-EU_R0805  [R0805]
R36  100K  R-EU_R0805  [R0805]
R37  1K5  R-EU_R0805  [R0805]
R38  180R  R-EU_R0805  [R0805]
R39  1K5  R-EU_R0805  [R0805]
R40  100R  R-EU_R0805  [R0805]
R41  10K  R-EU_R1206  [R1206]
R42  1K  R-EU_R0805  [R0805]
R43  1K  R-EU_R0805  [R0805]
X11  22-23-2021  [22-23-2021]
X12  22-23-2021  [22-23-2021]
ZD5  4V3  ZENER-DIODEMINIMELF  [MINIMELF]

### Nets
+5V: L2.P$1 LED_CC1.A LED_CC2.A LED_CV1.A LED_CV2.A ; also sheet 1,2,4
+5V_CH1: C45.1 IC17.1(A:E) IC17.4(B:E) IC18.4(R) IC18.8(V+) X11.1
+5V_CH2: C47.1 IC19.1(A:E) IC19.4(B:E) IC20.4(R) IC20.8(V+) X12.1
BATT_NTC1: OK1.4(COL) R29.2 ; also sheet 2
BATT_NTC2: OK2.4(COL) R37.2 ; also sheet 2
EXT_TRIG: R43.1 ; also sheet 2
GND [gnd]: C49.2 D9.1(A1) IC21.3(B:VSS) OK1.3(EMIT) OK2.3(EMIT) Q10.2(S) Q11.2(S) Q12.2(S) Q13.2(S) R28.2 R31.2 R35.2 R36.2 X2.4 X2.4.1 ZD5.A ; also sheet 1,2,3,4
GND_CH1: C45.2 C46.1 IC18.1(GND) OK1.2(C) X2.2 X2.2.1 X11.2
GND_CH2: C47.2 C48.1 IC20.1(GND) OK2.2(C) X4.2 X4.2.1 X12.2
LED_CC1: Q10.1(G) R28.1 ; also sheet 2
LED_CC2: Q12.1(G) R35.1 ; also sheet 2
LED_CV1: Q11.1(G) R31.1 ; also sheet 2
LED_CV2: Q13.1(G) R36.1 ; also sheet 2
N$1: IC21.4(A:O) R43.2
N$2: D9.2(C2) R40.1 ZD5.C
N$3: D8.A L2.P$2
N$4: R41.1 X2.3 X2.3.1
N$11: LED_CV1.C R27.2
N$12: Q12.3(D) R33.2
N$14: LED_CV2.C R34.2
N$15: LED_CC2.C R33.1
N$16: C46.2 IC18.2(TR) IC18.6(THR) R32.2
N$17: IC19.6(A:C) IC20.7(DIS) R39.1
N$18: IC17.6(A:C) IC18.7(DIS) R32.1
N$19: C48.2 IC20.2(TR) IC20.6(THR) R39.2
N$21: Q10.3(D) R26.2
N$22: OK1.1(A) R30.2
N$23: Q13.3(D) R34.1
N$26: D9.3(C1A2) R41.2 R42.2
N$27: IC21.2(A:I) R42.1
N$28: Q11.3(D) R27.1
N$29: LED_CC1.C R26.1
N$33: D8.C R40.2
N$36: OK2.1(A) R38.2
NTC1: IC17.2(A:B) IC17.3(B:C) IC17.5(B:B) X2.1 X2.1.1
NTC2: IC19.2(A:B) IC19.3(B:C) IC19.5(B:B) X4.1 X4.1.1
TEMP_FREQ1: IC18.3(Q) R30.1
TEMP_FREQ2: IC20.3(Q) R38.1
VCC [power]: C49.1 IC21.5(B:VDD) R29.1 R37.1 ; also sheet 2,4
Unconnected: IC18.5(CV) IC20.5(CV)

### Notes on the sheet
- CC/CV LED indicators | V/F converters for battery NTC (optional)
- Ch#1 Temp out
- Battery NTC
- Ch#2 Temp out
- External trigger protection and level shifter/buffer
- Ch#2 NTC
- Important: channel's supply is used for driving each NE555 separately. No not connect channels' +5V and ground with onboard supply!
- LED CC/CV indicators
- V/F converters for battery NTC (optional)
- Licensed under the TAPR Open Hardware License (www.tapr.org/OHL)
- More info at http://www.envox.hr/eez
- Repository: https://github.com/eez-open

## Library data of the parts
C1-C3 C5-C8 C10-C18 C20-C23 C25-C36 C38-C49 = rcl:C-EU: CAPACITOR, European symbol
C4 C9 C19 C24 = MyLib6:ECAP
C37 = EEZ_Lib1:SUPER_CAP: Electric Double Layer Supercapacitors, Type EDL Vertical - Manufacturer Part No: EDLSG105V5R5C Farnell: 2113011 Horizontal - Manufacturer Part No: EDLSG105H5R5C Farnell: 1364209, 9697497
D1-D5 D7 D8 = diode:DIODE-: DIODE
D6 = MyLib6:DIODE
D9 = diode:BAT54S: Schottky Diodes Pin connection corrected 2011-05-04 Source: Fairchild .. BAT54.pdf
IC1 = MyLib6:TLC5925IDBQR: CONSTANT-CURRENT LED SINK DRIVER; MPN: TLC5925IDBQR; OC_FARNELL: 1694438; OC_NEWARK: 46P3784; PACKAGE: SOP-24; SUPPLIER: Texas Instruments
IC2-IC5 IC7 IC8 = MyLib6:SN74LVCC3245ADBR: OCTAL BUS TRANSCEIVER WITH ADJUSTABLE OUTPUT VOLTAGE AND 3-STATE OUTPUTS; FARNELL: 2342537
IC6 = v-reg:LD117A?*: Low drop fixed and adjustable positive voltage regulators 1 A Source: http://www.st.com/stonline/products/literature/ds/7194/ld1117axx.pdf
IC9 IC13 = MyLib6:SI8660: Low power 6-ch digital isolator (6+0); FARNELL: 2423356
IC10 = MyLib6:SN74LV125A: Quadruple Bus Buffer Gates With 3-State Outputs; FARNELL: 9592512; TME: SN74LV125APW
IC11 IC12 = MyLib6:SI8620: Low power 2-ch digital isolator (2+0) Farnell: 2423240, 2423241
IC14 = MyLib6:PCA21125: SPI-bus Real-Time Clock and calendar Farnell: 2400445
IC15 = MyLib6:AT25XXX: SPI Serial EEPROM, Supports SPI Modes 0 (0,0) and 3 (1,1) Atmel AT25128 128K (16 384 x 8) Farnell: 2345601 Atmel AT25256 256K (32 768 x 8) Farnell: 1841577 Atmel AT25512 512K (65 536 x 8) Farnell: 2345608
IC16 = MyLib6:ENC28J60-I/SS: Stand-Alone Ethernet Controller; MPN: ENC28J60-I/SS; OC_FARNELL: 1084620; OC_NEWARK: 31K1708; PACKAGE: SOP-28; SUPPLIER: Microchip
IC17 IC19 = MyLib6:BC857BS: PNP general purpose dual transistor
IC18 IC20 = MyLib6:LM555
IC21 = EEZ_Lib1:SN74LV1T34: Single Power Supply Single Buffer GATE CMOS Logic Level Shifter; FARNELL: 2499914
J1-J5 = EEZ_Lib1:BINDING_POST
JP1 JP3 = jumper:JP1E: JUMPER
JP2 = MyLib6:JUMPER_3-PIN
JP4 = jump-0r-smd:0R-JUMP: SMD 0R 0805 Jumper
K_PAR K_SER = EEZ_Lib1:RELAY_RT314012
K_S1 K_S2 = relay:G6K: Low Signal Relay oeiwcsnts1.omron.com/.. D20G6K0100.pdf; MF: OMRON COMPONENTS USA; MPN: G6K-2F DC24; OC_FARNELL: 1690427; OC_NEWARK: 36K7467
L1 = MyLib6:FERRITE_BEAD: FAIR-RITE - 2506033007Y3 - FERRITE BEAD, 0.04OHM, 3A, 0603 Farnell: 2112873
L2 = EEZ_Lib1:FERRITE_BEAD: FAIR-RITE - 2506033007Y3 - FERRITE BEAD, 0.04OHM, 3A, 0603 Farnell: 2112873
LCD1 = MyLib6:LCD_TFT_320QVT: 3.2" 320x240 TFT Module Display Touch Panel with PCB 262K Colors IC SSD1289
LED_01_NEG LED_01_POS = EEZ_Lib1:LED_KPB-3025: Kingbright 3.0x2.5mm SURFACE MOUNT LED LAMP
LED_CC1 LED_CC2 LED_CV1 LED_CV2 LED_O2+ LED_O2- LED_PWR LED_S1 LED_S2 = led:LED: LED OSRAM: - CHIPLED LG R971, LG N971, LY N971, LG Q971, LY Q971, LO R971, LY R971 LH N974, LH R974 LS Q976, LO Q976, LY Q976 LO Q996 - Hyper CHIPLED LW Q18S LB Q993, LB Q99A, LB R99A - SideLED LS A670, LO A670, LY A670, LG A670, LP A670 LB A673, LV A673, LT A673, LW A673 LH A674 LY A675 LS A676, LA A676, LO A676, LY A676, LW A676 LS A679, LY A679, LG A679 - Hyper Micro SIDELED® LS Y876, LA Y876, LO Y876, LY Y876 LT Y87S - SmartLED LW L88C, LW L88S LB L89C, LB L89S, LG L890 LS L89K, LO L89K, LY L89K LS L896, LA L896, LO L896, LY L896 - TOPLED LS T670, LO T670, LY T670, LG T670, LP T670 LSG T670, LSP T670, LSY T670, LOP T670, LYG T670 LG T671, LOG T671, LSG T671 LB T673, LV T673, LT T673, LW T673 LH T674 LS T676, LA T676, LO T676, LY T676, LB T676, LH T676, LSB T676, LW T676 LB T67C, LV T67C, LT T67C, LS T67K, LO T67K, LY T67K, LW E67C LS E67B, LA E67B, LO E67B, LY E67B, LB E67C, LV E67C, LT E67C LW T67C LS T679, LY T679, LG T679 LS T770, LO T770, LY T770, LG T770, LP T770 LB T773, LV T773, LT T773, LW T773 LH T774 LS E675, LA E675, LY E675, LS T675 LS T776, LA T776, LO T776, LY T776, LB T776 LHGB T686 LT T68C, LB T68C - Hyper Mini TOPLED® LB M676 - Mini TOPLED Santana® LG M470 LS M47K, LO M47K, LY M47K Source: http://www.osram.convergy.de LUXEON: - LUMILED® LXK2-PW12-R00, LXK2-PW12-S00, LXK2-PW14-U00, LXK2-PW14-V00 LXK2-PM12-R00, LXK2-PM12-S00, LXK2-PM14-U00 LXK2-PE12-Q00, LXK2-PE12-R00, LXK2-PE12-S00, LXK2-PE14-T00, LXK2-PE14-U00 LXK2-PB12-K00, LXK2-PB12-L00, LXK2-PB12-M00, LXK2-PB14-N00, LXK2-PB14-P00, LXK2-PB14-Q00 LXK2-PR12-L00, LXK2-PR12-M00, LXK2-PR14-Q00, LXK2-PR14-R00 LXK2-PD12-Q00, LXK2-PD12-R00, LXK2-PD12-S00 LXK2-PH12-R00, LXK2-PH12-S00 LXK2-PL12-P00, LXK2-PL12-Q00, LXK2-PL12-R00 Source: www.luxeon.com KINGBRIGHT: KA-3528ASYC Source: www.kingbright.com
MCU = EEZ_Lib1:ARDUINO_MEGA+ICSP
OK1 OK2 = EEZ_Lib1:HCPL-181: Phototransistor Optocoupler SMD Mini-Flat Type
Q1-Q3 Q5 Q9 = MyLib6:IRLML2246TRPBF: HEXFET Power MOSFET (-20V, -2.6A); MPN: IRLML2246TRPBF; OC_FARNELL: 1888166; OC_NEWARK: 40T7450; PACKAGE: SOT-3; SUPPLIER: International Rectifier; TME: IRLML2246TRPBF
Q4 Q6-Q8 Q10-Q13 = MyLib6:2N7002: N-CHANNEL ENHANCEMENT MODE FIELD EFFECT TRANSISTOR; MPN: 2N7002-7-F; OC_FARNELL: 1713823; OC_NEWARK: 25R5679; PACKAGE: SOT-23-3; SUPPLIER: DIODES INC.
R1-R40 R42 R43 = rcl:R-EU_: RESISTOR, European symbol
R41 = resistor:R-EU_: RESISTOR, European symbol
SG1 = MyLib6:BUZZER
SW1 = MyLib6:TACT_SW
TP1 = MyLib6:PCB_TEST_TAB
X1 X3 = EEZ_Lib1:TBLOCK5.0_4A
X2 X4 = EEZ_Lib1:MC000005: Wire-To-Board Terminal Block, 6, 150 V, 6 A, 26 AWG, 20 AWG No. of Positions:6; Rated Voltage:150V; Rated Current:6A
X5 X9 X11 X12 = con-molex:22-23-2021: .100" (2.54mm) Center Header - 2 Pin; MF: MOLEX; MPN: 22-23-2021; OC_FARNELL: 1462926; OC_NEWARK: 25C3832
X6 = con-molex:22-23-2041: .100" (2.54mm) Center Header - 4 Pin; MF: MOLEX; MPN: 22-23-2041; OC_FARNELL: 1462920; OC_NEWARK: 38C0355
X7 X8 = MyLib6:IDC-10PIN: 10-pin IDC socket male, straight; TME: 09185106324
X10 = EEZ_Lib1:RJ45-TRAFO-LED: AMPHENOL LMJTAB881243M-L Socket; RJ45; PIN:8; shielded, with LED and trafo; TME: LMJTAB881243M-L
Y1 Y2 = MyLib6:XTAL
ZD1-ZD4 = EEZ_Lib1:PSMAXX: Transient Voltage Suppressor, TVS, P4SMA Series, Unidirectional
ZD5 = EEZ_Lib1:ZENER-DIODE

## Net classes
0 default: width 0.254 mm, drill 0.584 mm, clearance 0.254 mm
1 power: width 0.254 mm, drill 0.584 mm, clearance 0.203 mm
2 gnd: width 0.254 mm, drill 0.584 mm, clearance 0.203 mm
3 isolators: width 0.254 mm, drill 0.584 mm, clearance 0.254 mm